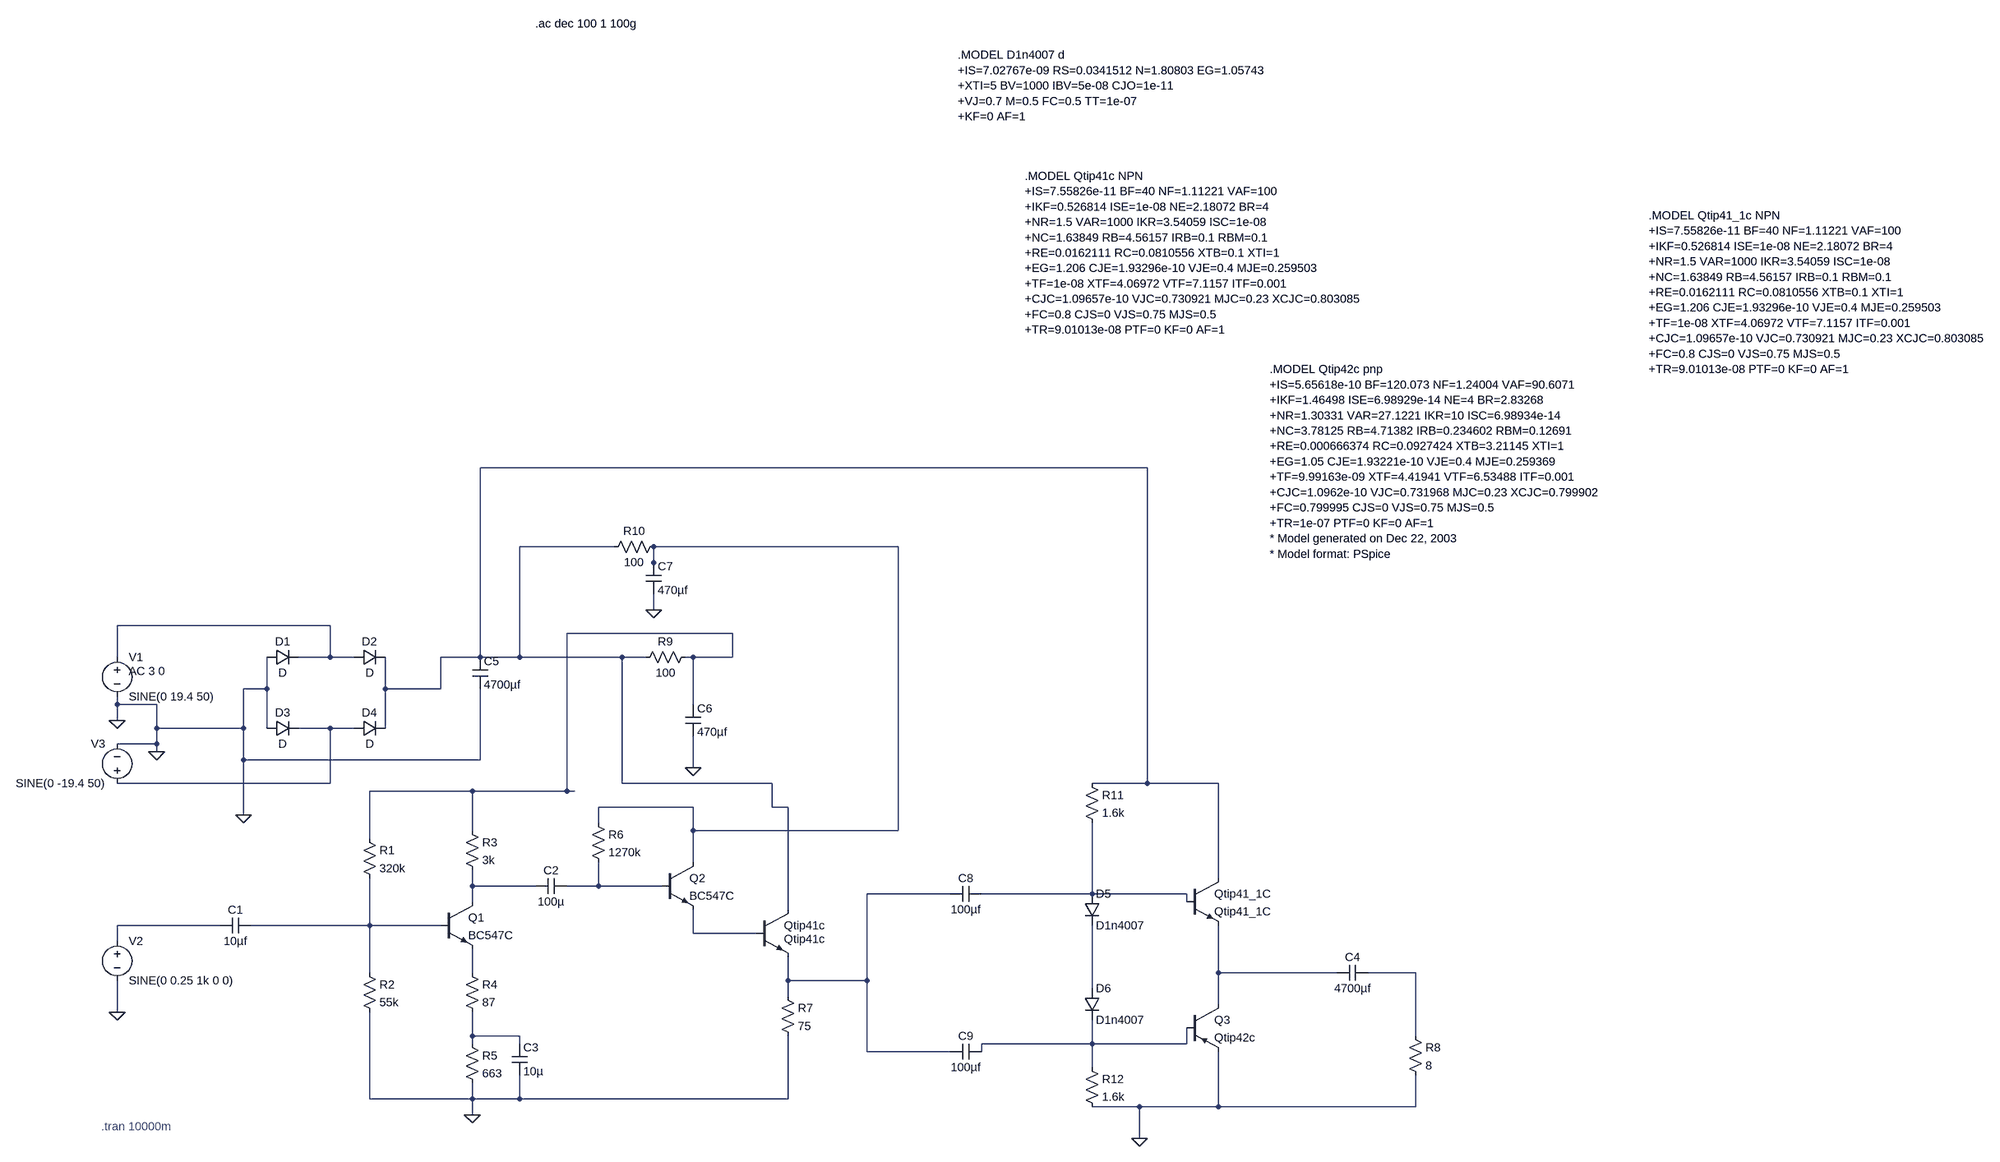
[diagram p0: schematic filter_1.asc]
filter_1.asc, the LTspice schematic file:
Version 4.1
SHEET 1 3748 680
WIRE 1776 -928 240 -928
WIRE 512 -768 320 -768
WIRE 1088 -768 592 -768
WIRE 592 -736 592 -768
WIRE 592 -720 592 -736
WIRE 592 -640 592 -672
WIRE -64 -608 -496 -608
WIRE 752 -592 416 -592
WIRE -496 -544 -496 -608
WIRE -64 -544 -64 -608
WIRE -64 -544 -128 -544
WIRE -16 -544 -64 -544
WIRE 240 -544 240 -928
WIRE 240 -544 160 -544
WIRE 320 -544 320 -768
WIRE 320 -544 240 -544
WIRE 528 -544 320 -544
WIRE 576 -544 528 -544
WIRE 672 -544 656 -544
WIRE 752 -544 752 -592
WIRE 752 -544 672 -544
WIRE -192 -480 -192 -544
WIRE -192 -480 -240 -480
WIRE 48 -480 48 -544
WIRE 160 -480 160 -544
WIRE 160 -480 48 -480
WIRE -496 -448 -496 -464
WIRE -416 -448 -496 -448
WIRE 672 -448 672 -544
WIRE -496 -416 -496 -448
WIRE -416 -400 -416 -448
WIRE -240 -400 -240 -480
WIRE -240 -400 -416 -400
WIRE -192 -400 -192 -480
WIRE -64 -400 -128 -400
WIRE -16 -400 -64 -400
WIRE 48 -400 48 -480
WIRE -416 -368 -416 -400
WIRE -416 -368 -496 -368
WIRE -416 -352 -416 -368
WIRE -240 -336 -240 -400
WIRE 240 -336 240 -480
WIRE 240 -336 -240 -336
WIRE 672 -320 672 -384
WIRE -64 -288 -64 -400
WIRE -64 -288 -496 -288
WIRE 528 -288 528 -544
WIRE 832 -288 528 -288
WIRE 1776 -288 1776 -928
WIRE 1776 -288 1664 -288
WIRE 1920 -288 1776 -288
WIRE 224 -272 16 -272
WIRE 416 -272 416 -592
WIRE 416 -272 224 -272
WIRE 432 -272 416 -272
WIRE 672 -240 480 -240
WIRE 832 -240 832 -288
WIRE 864 -240 832 -240
WIRE -240 -224 -240 -336
WIRE 480 -208 480 -240
WIRE 224 -192 224 -272
WIRE 672 -192 672 -240
WIRE 1088 -192 1088 -768
WIRE 1088 -192 672 -192
WIRE 16 -176 16 -272
WIRE 672 -128 672 -192
WIRE 1920 -96 1920 -288
WIRE 224 -80 224 -112
WIRE 352 -80 224 -80
WIRE 480 -80 480 -128
WIRE 480 -80 416 -80
WIRE 608 -80 480 -80
WIRE 1376 -64 1024 -64
WIRE 1664 -64 1664 -208
WIRE 1664 -64 1440 -64
WIRE 1856 -64 1664 -64
WIRE 224 -48 224 -80
WIRE 1856 -48 1856 -64
WIRE 864 -32 864 -240
WIRE -288 0 -496 0
WIRE 16 0 16 -96
WIRE 16 0 -224 0
WIRE 160 0 16 0
WIRE 672 16 672 -32
WIRE 800 16 672 16
WIRE -496 32 -496 0
WIRE 16 96 16 0
WIRE 224 96 224 48
WIRE 1920 96 1920 0
WIRE 2160 96 1920 96
WIRE 2320 96 2224 96
WIRE 864 112 864 64
WIRE 1024 112 1024 -64
WIRE 1024 112 864 112
WIRE 1664 128 1664 0
WIRE 864 144 864 112
WIRE 1920 160 1920 96
WIRE -496 176 -496 112
WIRE 224 224 224 176
WIRE 320 224 224 224
WIRE 2320 224 2320 96
WIRE 224 240 224 224
WIRE 320 240 320 224
WIRE 1664 240 1664 192
WIRE 1664 240 1440 240
WIRE 1856 240 1856 208
WIRE 1856 240 1664 240
WIRE 1024 256 1024 112
WIRE 1376 256 1024 256
WIRE 1440 256 1440 240
WIRE 1664 288 1664 240
WIRE 16 352 16 176
WIRE 224 352 224 320
WIRE 224 352 16 352
WIRE 320 352 320 304
WIRE 320 352 224 352
WIRE 864 352 864 224
WIRE 864 352 320 352
WIRE 1760 368 1664 368
WIRE 1920 368 1920 256
WIRE 1920 368 1760 368
WIRE 2320 368 2320 304
WIRE 2320 368 1920 368
WIRE 224 384 224 352
WIRE 1760 432 1760 368
FLAG 224 384 0
FLAG -496 176 0
FLAG -240 -224 0
FLAG -496 -416 0
FLAG -416 -352 0
FLAG 672 -320 0
FLAG 592 -640 0
FLAG 1760 432 0
SYMBOL res 0 -192 R0
SYMATTR InstName R1
SYMATTR Value 320k
SYMBOL res 0 80 R0
SYMATTR InstName R2
SYMATTR Value 55k
SYMBOL res 208 -208 R0
SYMATTR InstName R3
SYMATTR Value 3k
SYMBOL res 208 80 R0
SYMATTR InstName R4
SYMATTR Value 87
SYMBOL res 208 224 R0
SYMATTR InstName R5
SYMATTR Value 663
SYMBOL cap -288 16 R270
WINDOW 0 32 32 VTop 2
WINDOW 3 0 32 VBottom 2
SYMATTR InstName C1
SYMATTR Value 10µf
SYMBOL cap 416 -96 R90
WINDOW 0 0 32 VBottom 2
WINDOW 3 32 32 VTop 2
SYMATTR InstName C2
SYMATTR Value 100µ
SYMBOL cap 304 240 R0
SYMATTR InstName C3
SYMATTR Value 10µ
SYMBOL npn 160 -48 R0
SYMATTR InstName Q1
SYMATTR Value BC547C
SYMBOL voltage -496 16 R0
WINDOW 123 0 0 Left 0
WINDOW 39 0 0 Left 0
SYMATTR InstName V2
SYMATTR Value SINE(0 0.25 1k 0 0)
SYMBOL res 464 -224 R0
SYMATTR InstName R6
SYMATTR Value 1270k
SYMBOL npn 608 -128 R0
SYMATTR InstName Q2
SYMATTR Value BC547C
SYMBOL npn 800 -32 R0
WINDOW 3 56 60 Left 2
SYMATTR Value Qtip41c
SYMATTR InstName Qtip41c
SYMBOL res 848 128 R0
SYMATTR InstName R7
SYMATTR Value 75
SYMBOL diode -192 -528 R270
WINDOW 0 32 32 VTop 2
WINDOW 3 0 32 VBottom 2
SYMATTR InstName D1
SYMBOL diode -16 -528 R270
WINDOW 0 32 32 VTop 2
WINDOW 3 0 32 VBottom 2
SYMATTR InstName D2
SYMBOL diode -192 -384 R270
WINDOW 0 32 32 VTop 2
WINDOW 3 0 32 VBottom 2
SYMATTR InstName D3
SYMBOL diode -16 -384 R270
WINDOW 0 32 32 VTop 2
WINDOW 3 0 32 VBottom 2
SYMATTR InstName D4
SYMBOL voltage -496 -560 R0
WINDOW 123 24 44 Left 2
WINDOW 39 0 0 Left 0
SYMATTR Value2 AC 3 0
SYMATTR InstName V1
SYMATTR Value SINE(0 19.4 50)
SYMBOL voltage -496 -272 R180
WINDOW 0 24 96 Left 2
WINDOW 3 24 16 Left 2
WINDOW 123 0 0 Left 0
WINDOW 39 0 0 Left 0
SYMATTR InstName V3
SYMATTR Value SINE(0 -19.4 50)
SYMBOL cap 224 -544 R0
SYMATTR InstName C5
SYMATTR Value 4700µf
SYMBOL res 672 -560 R90
WINDOW 0 0 56 VBottom 2
WINDOW 3 32 56 VTop 2
SYMATTR InstName R9
SYMATTR Value 100
SYMBOL cap 656 -448 R0
SYMATTR InstName C6
SYMATTR Value 470µf
SYMBOL res 608 -784 R90
WINDOW 0 0 56 VBottom 2
WINDOW 3 32 56 VTop 2
SYMATTR InstName R10
SYMATTR Value 100
SYMBOL cap 576 -736 R0
SYMATTR InstName C7
SYMATTR Value 470µf
SYMBOL pnp 1856 160 R0
SYMATTR InstName Q3
SYMATTR Value Qtip42c
SYMATTR Prefix Q
SYMBOL npn 1856 -96 R0
SYMATTR InstName Qtip41_1C
SYMATTR Value Qtip41_1C
SYMBOL cap 1440 -80 R90
WINDOW 0 0 32 VBottom 2
WINDOW 3 32 32 VTop 2
SYMATTR InstName C8
SYMATTR Value 100µf
SYMBOL cap 1440 240 R90
WINDOW 0 0 32 VBottom 2
WINDOW 3 32 32 VTop 2
SYMATTR InstName C9
SYMATTR Value 100µf
SYMBOL res 1648 -304 R0
SYMATTR InstName R11
SYMATTR Value 1.6k
SYMBOL res 1648 272 R0
SYMATTR InstName R12
SYMATTR Value 1.6k
SYMBOL diode 1648 -64 R0
SYMATTR InstName D5
SYMATTR Value D1n4007
SYMBOL diode 1648 128 R0
SYMATTR InstName D6
SYMATTR Value D1n4007
SYMBOL cap 2224 80 R90
WINDOW 0 0 32 VBottom 2
WINDOW 3 32 32 VTop 2
SYMATTR InstName C4
SYMATTR Value 4700µf
SYMBOL res 2304 208 R0
SYMATTR InstName R8
SYMATTR Value 8
TEXT -528 408 Left 2 ;.tran 10000m
TEXT 1528 -1520 Left 2 !.MODEL Qtip41c NPN\n+IS=7.55826e-11 BF=40 NF=1.11221 VAF=100\n+IKF=0.526814 ISE=1e-08 NE=2.18072 BR=4\n+NR=1.5 VAR=1000 IKR=3.54059 ISC=1e-08\n+NC=1.63849 RB=4.56157 IRB=0.1 RBM=0.1\n+RE=0.0162111 RC=0.0810556 XTB=0.1 XTI=1\n+EG=1.206 CJE=1.93296e-10 VJE=0.4 MJE=0.259503\n+TF=1e-08 XTF=4.06972 VTF=7.1157 ITF=0.001\n+CJC=1.09657e-10 VJC=0.730921 MJC=0.23 XCJC=0.803085\n+FC=0.8 CJS=0 VJS=0.75 MJS=0.5\n+TR=9.01013e-08 PTF=0 KF=0 AF=1
TEXT 2024 -1128 Left 2 !.MODEL Qtip42c pnp\n+IS=5.65618e-10 BF=120.073 NF=1.24004 VAF=90.6071\n+IKF=1.46498 ISE=6.98929e-14 NE=4 BR=2.83268\n+NR=1.30331 VAR=27.1221 IKR=10 ISC=6.98934e-14\n+NC=3.78125 RB=4.71382 IRB=0.234602 RBM=0.12691\n+RE=0.000666374 RC=0.0927424 XTB=3.21145 XTI=1\n+EG=1.05 CJE=1.93221e-10 VJE=0.4 MJE=0.259369\n+TF=9.99163e-09 XTF=4.41941 VTF=6.53488 ITF=0.001\n+CJC=1.0962e-10 VJC=0.731968 MJC=0.23 XCJC=0.799902\n+FC=0.799995 CJS=0 VJS=0.75 MJS=0.5\n+TR=1e-07 PTF=0 KF=0 AF=1\n* Model generated on Dec 22, 2003\n* Model format: PSpice
TEXT 1392 -1872 Left 2 !.MODEL D1n4007 d\n+IS=7.02767e-09 RS=0.0341512 N=1.80803 EG=1.05743\n+XTI=5 BV=1000 IBV=5e-08 CJO=1e-11\n+VJ=0.7 M=0.5 FC=0.5 TT=1e-07\n+KF=0 AF=1
TEXT 3024 -1440 Left 2 !.MODEL Qtip41_1c NPN\n+IS=7.55826e-11 BF=40 NF=1.11221 VAF=100\n+IKF=0.526814 ISE=1e-08 NE=2.18072 BR=4\n+NR=1.5 VAR=1000 IKR=3.54059 ISC=1e-08\n+NC=1.63849 RB=4.56157 IRB=0.1 RBM=0.1\n+RE=0.0162111 RC=0.0810556 XTB=0.1 XTI=1\n+EG=1.206 CJE=1.93296e-10 VJE=0.4 MJE=0.259503\n+TF=1e-08 XTF=4.06972 VTF=7.1157 ITF=0.001\n+CJC=1.09657e-10 VJC=0.730921 MJC=0.23 XCJC=0.803085\n+FC=0.8 CJS=0 VJS=0.75 MJS=0.5\n+TR=9.01013e-08 PTF=0 KF=0 AF=1
TEXT 352 -1936 Left 2 !.ac dec 100 1 100g

The netlist it stands for:
* filter_1.asc
R1 N004 N011 320k
R2 N011 0 55k
R3 N004 N006 3k
R4 N013 N017 87
R5 N017 0 663
C1 N010 N011 10µf
C2 N007 N006 100µ
C3 N017 0 10µ
Q1 N006 N011 N013 0 BC547C
V2 N010 0 SINE(0 0.25 1k 0 0)
R6 N002 N007 1270k
Q2 N002 N007 N012 0 BC547C
Qtip41c N001 N012 N008 0 Qtip41c
R7 N008 0 75
D1 0 N003 D
D2 N003 N001 D
D3 0 N005 D
D4 N005 N001 D
V1 N003 0 SINE(0 19.4 50) AC 3 0
V3 N005 0 SINE(0 -19.4 50)
C5 N001 0 4700µf
R9 N004 N001 100
C6 N004 0 470µf
R10 N002 N001 100
C7 N002 0 470µf
Q3 N014 N018 0 0 Qtip42c
Qtip41_1C N001 N009 N014 0 Qtip41_1C
C8 N009 N008 100µf
C9 N018 N008 100µf
R11 N001 N009 1.6k
R12 N018 0 1.6k
D5 N009 N016 D1n4007
D6 N016 N018 D1n4007
C4 N015 N014 4700µf
R8 N015 0 8
.model D D
.lib standard.dio
.model NPN NPN
.model PNP PNP
.lib standard.bjt
* .tran 10000m
.MODEL Qtip41c NPN
+IS=7.55826e-11 BF=40 NF=1.11221 VAF=100
+IKF=0.526814 ISE=1e-08 NE=2.18072 BR=4
+NR=1.5 VAR=1000 IKR=3.54059 ISC=1e-08
+NC=1.63849 RB=4.56157 IRB=0.1 RBM=0.1
+RE=0.0162111 RC=0.0810556 XTB=0.1 XTI=1
+EG=1.206 CJE=1.93296e-10 VJE=0.4 MJE=0.259503
+TF=1e-08 XTF=4.06972 VTF=7.1157 ITF=0.001
+CJC=1.09657e-10 VJC=0.730921 MJC=0.23 XCJC=0.803085
+FC=0.8 CJS=0 VJS=0.75 MJS=0.5
+TR=9.01013e-08 PTF=0 KF=0 AF=1
.MODEL Qtip42c pnp
+IS=5.65618e-10 BF=120.073 NF=1.24004 VAF=90.6071
+IKF=1.46498 ISE=6.98929e-14 NE=4 BR=2.83268
+NR=1.30331 VAR=27.1221 IKR=10 ISC=6.98934e-14
+NC=3.78125 RB=4.71382 IRB=0.234602 RBM=0.12691
+RE=0.000666374 RC=0.0927424 XTB=3.21145 XTI=1
+EG=1.05 CJE=1.93221e-10 VJE=0.4 MJE=0.259369
+TF=9.99163e-09 XTF=4.41941 VTF=6.53488 ITF=0.001
+CJC=1.0962e-10 VJC=0.731968 MJC=0.23 XCJC=0.799902
+FC=0.799995 CJS=0 VJS=0.75 MJS=0.5
+TR=1e-07 PTF=0 KF=0 AF=1
* Model generated on Dec 22, 2003
* Model format: PSpice
.MODEL D1n4007 d
+IS=7.02767e-09 RS=0.0341512 N=1.80803 EG=1.05743
+XTI=5 BV=1000 IBV=5e-08 CJO=1e-11
+VJ=0.7 M=0.5 FC=0.5 TT=1e-07
+KF=0 AF=1
.MODEL Qtip41_1c NPN
+IS=7.55826e-11 BF=40 NF=1.11221 VAF=100
+IKF=0.526814 ISE=1e-08 NE=2.18072 BR=4
+NR=1.5 VAR=1000 IKR=3.54059 ISC=1e-08
+NC=1.63849 RB=4.56157 IRB=0.1 RBM=0.1
+RE=0.0162111 RC=0.0810556 XTB=0.1 XTI=1
+EG=1.206 CJE=1.93296e-10 VJE=0.4 MJE=0.259503
+TF=1e-08 XTF=4.06972 VTF=7.1157 ITF=0.001
+CJC=1.09657e-10 VJC=0.730921 MJC=0.23 XCJC=0.803085
+FC=0.8 CJS=0 VJS=0.75 MJS=0.5
+TR=9.01013e-08 PTF=0 KF=0 AF=1
.ac dec 100 1 100g
.backanno
.end